# Altium schematic sheet misc.SchDoc: Miscellaneous Devices
size A4; Author: AJ; DrawnBy: AJ; Engineer: AJ; DocumentNumber: 6; Revision: 003; SheetNumber: 6; SheetTotal: 6
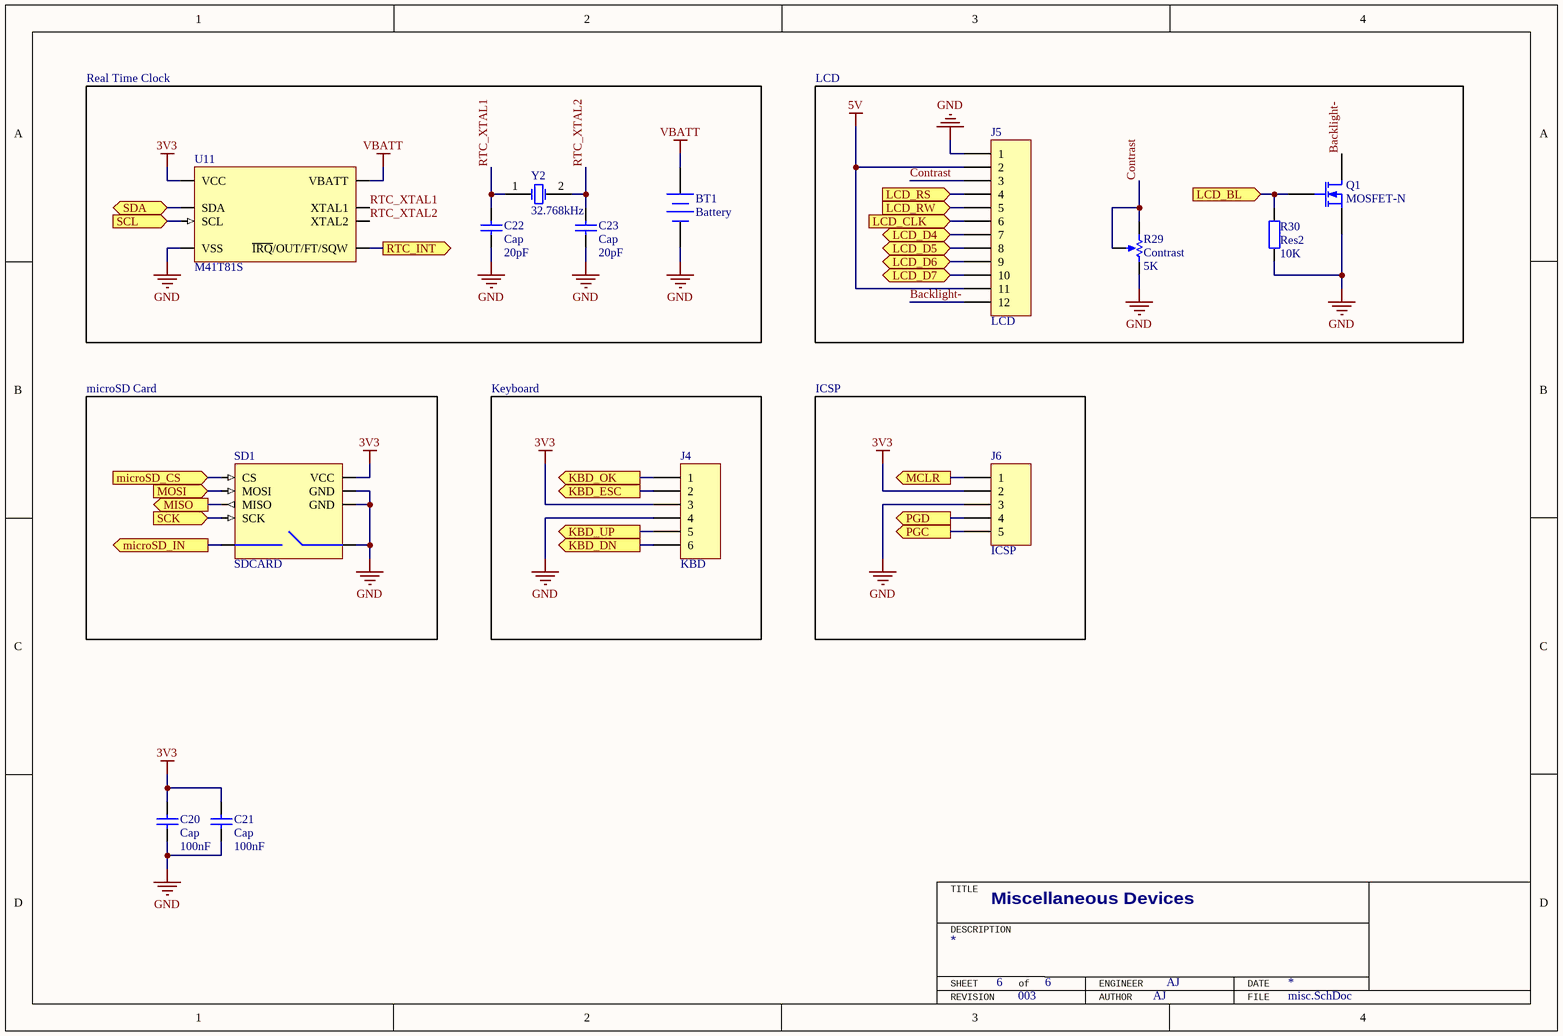
[diagram p0: misc.SchDoc]

## Parts
BT1  Battery  [Coin Cell]
C20  Cap  value 100nF  [0603]
C21  Cap  value 100nF  [0603]
C22  Cap  value 20pF  [0603]
C23  Cap  value 20pF  [0603]
J4  KBD  [HDR1X6]
J5  LCD  [HDR1X12]
J6  ICSP  [HDR1X5]
Q1  MOSFET-N  [SOT323]
R29  Contrast  value 5K  [Potentiometer]
R30  Res2  value 10K  [0603]
SD1  SDCARD  [microSD connector]
U11  M41T81S  [SO-8]
Y2  32.768kHz  [CM200S]

## Blocks framed on the sheet
Real Time Clock: BT1 C22 C23 U11 Y2
LCD: J5 Q1 R29 R30
microSD Card: SD1
Keyboard: J4
ICSP: J6

## Ports
KBD_DN (out), KBD_ESC (out), KBD_OK (out), KBD_UP (out), LCD_BL (in), LCD_CLK (in), LCD_D4 (bidir), LCD_D5 (bidir), LCD_D6 (bidir), LCD_D7 (bidir), LCD_RS (in), LCD_RW (in), MCLR (out), microSD_CS (in), microSD_IN (out), MISO (out), MOSI (in), PGC (out), PGD (out), RTC_INT (out), SCK (in), SCL (in), SDA (bidir)

## Nets
3V3: C20.2 C21.2 J4.3 J6.2 SD1.4(VCC) U11.8(VCC)
5V: J5.2 J5.11
GND: BT1.2(-) C20.1 C21.1 C22.1 C23.1 J4.4 J5.1 J6.3 Q1.3(S) R29.2(BOT) R30.1 SD1.3(GND) SD1.6(GND) SD1.10(B) U11.4(VSS)
VBATT: BT1.1(+) U11.3(VBATT)
Backlight-: J5.12 Q1.1(D)
Contrast: J5.3 R29.1(TOP) R29.3(TAP)
KBD_DN: J4.6 ; port KBD_DN
KBD_ESC: J4.2 ; port KBD_ESC
KBD_OK: J4.1 ; port KBD_OK
KBD_UP: J4.5 ; port KBD_UP
LCD_BL: Q1.2(G) R30.2 ; port LCD_BL
LCD_CLK: J5.6 ; port LCD_CLK
LCD_D4: J5.7 ; port LCD_D4
LCD_D5: J5.8 ; port LCD_D5
LCD_D6: J5.9 ; port LCD_D6
LCD_D7: J5.10 ; port LCD_D7
LCD_RS: J5.4 ; port LCD_RS
LCD_RW: J5.5 ; port LCD_RW
MCLR: J6.1 ; port MCLR
microSD_CS: SD1.1(CS) ; port microSD_CS
microSD_IN: SD1.9(A) ; port microSD_IN
MISO: SD1.7(MISO) ; port MISO
MOSI: SD1.2(MOSI) ; port MOSI
PGC: J6.5 ; port PGC
PGD: J6.4 ; port PGD
RTC_INT: U11.7(~{IRQ}/OUT/FT/SQW) ; port RTC_INT
RTC_XTAL1: C22.2 U11.1(XTAL1) Y2.1(OSC1)
RTC_XTAL2: C23.2 U11.2(XTAL2) Y2.2(OSC2)
SCK: SD1.5(SCK) ; port SCK
SCL: U11.6(SCL) ; port SCL
SDA: U11.5(SDA) ; port SDA

## Notes on the sheet
- TITLE
- DESCRIPTION
- SHEET
- of
- ENGINEER
- DATE
- REVISION
- AUTHOR
- FILE

## Library data of the parts
BT1 = Battery: Multicell Battery; Published: 24-Mar-1999; LatestRevisionDate: 17-Jul-2002; LatestRevisionNote: Re-released for DXP Platform.; PackageReference: BAT-2; Publisher: Altium Limited
C20-C23 = Cap: Capacitor; Published: 8-Jun-2000; LatestRevisionDate: 17-Jul-2002; LatestRevisionNote: Re-released for DXP Platform.; PackageReference: RAD-0.3; Publisher: Altium Limited
J4 = Header 6: Header, 6-Pin; LatestRevisionDate: 17-Jul-2002; LatestRevisionNote: Re-released for DXP Platform.; Publisher: Altium Limited
J5 = Header 12: Header, 12-Pin; LatestRevisionDate: 17-Jul-2002; LatestRevisionNote: Re-released for DXP Platform.; Publisher: Altium Limited
J6 = Header 5: Header, 5-Pin; LatestRevisionDate: 17-Jul-2002; LatestRevisionNote: Re-released for DXP Platform.; Publisher: Altium Limited
Q1 = MOSFET-N: N-Channel MOSFET; Published: 8-Jun-2000; LatestRevisionDate: 17-Jul-2002; LatestRevisionNote: Re-released for DXP Platform.; PackageVersion: 1995/1996; PackageReference: E3; Publisher: Altium Limited
R29 = RPot: Potentiometer; Sim Note: Enter the Resistance value and the set point into parameter fields.; Set Position: 0.5; Published: 8-Jun-2000; LatestRevisionDate: 17-Jul-2002; LatestRevisionNote: Re-released for DXP Platform.; PackageReference: VR5; Publisher: Altium Limited
R30 = Res2: Resistor; Published: 8-Jun-2000; LatestRevisionDate: 17-Jul-2002; LatestRevisionNote: Re-released for DXP Platform.; PackageReference: AXIAL-0.4; Publisher: Altium Limited
SD1 = SD Card: SD Card, SPI interface
U11 = M41T81S: Serial access real-time clock with alarms
Y2 = XTAL: Crystal Oscillator; Published: 8-Jun-2000; LatestRevisionDate: 17-Jul-2002; LatestRevisionNote: Re-released for DXP Platform.; PackageReference: R38; Publisher: Altium Limited